# EAGLE design schematic (EAGLE 9.4.2)
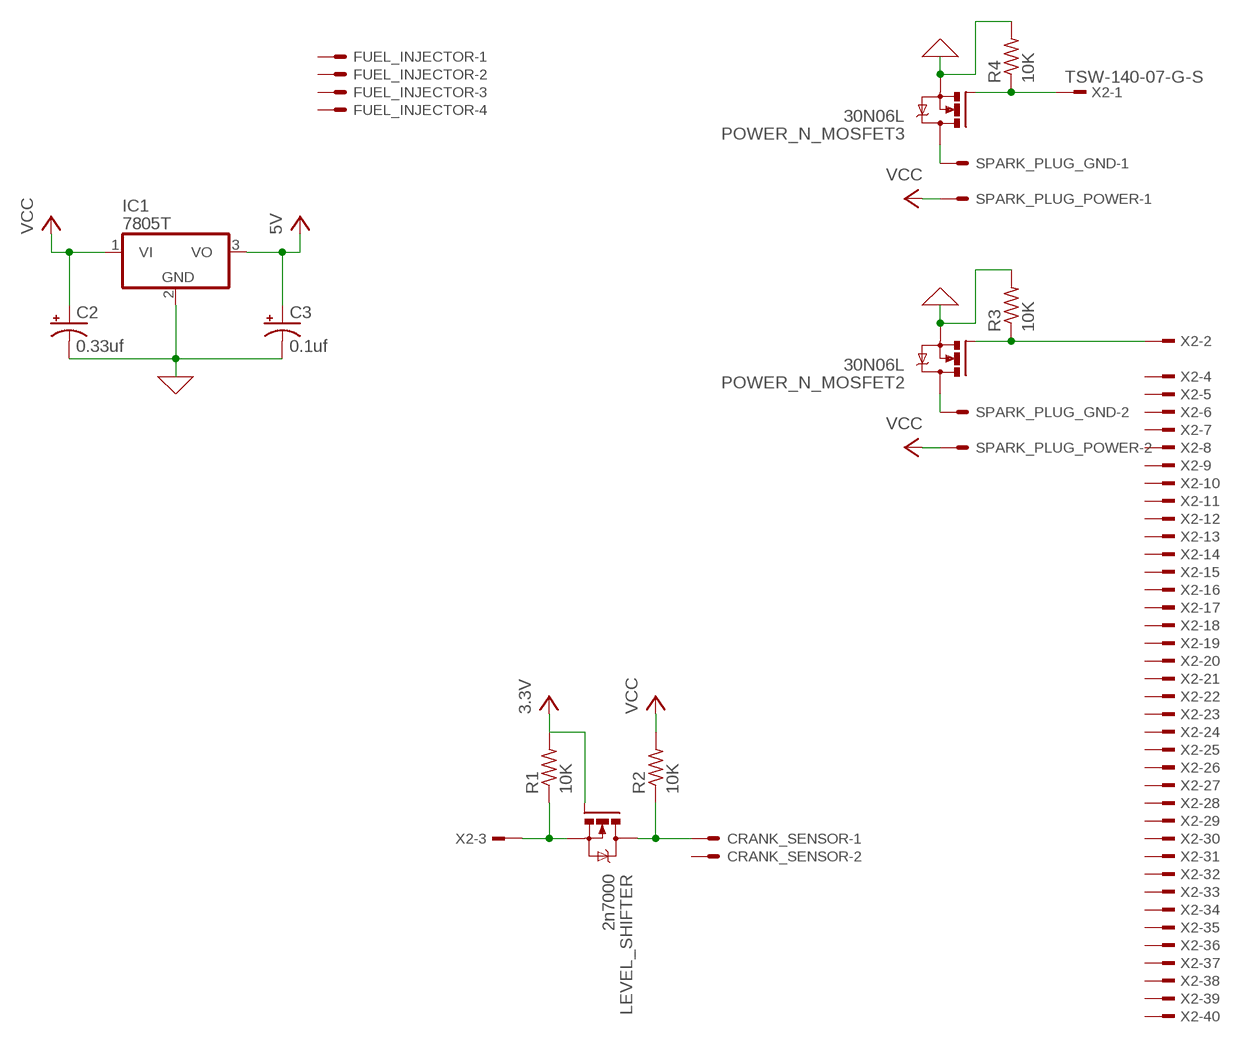
[diagram p0: schematic, sheet 1]

## Parts
C2  0.33uf  CPOL-USE2.5-5  [E2,5-5]
C3  0.1uf  CPOL-USE2.5-5  [E2,5-5]
CRANK_SENSOR  KK-156-2  [KK-156-2]
FUEL_INJECTOR  KK-156-4  [KK-156-4]
IC1  7805T  [TO220H]
LEVEL_SHIFTER  2n7000  IRF520  [TO220BV]
POWER_N_MOSFET2  30N06L  IRF520  [TO220BV]
POWER_N_MOSFET3  30N06L  IRF520  [TO220BV]
R1  10K  R-US_0207/7  [0207/7]
R2  10K  R-US_0207/7  [0207/7]
R3  10K  R-US_0207/7  [0207/7]
R4  10K  R-US_0207/7  [0207/7]
SPARK_PLUG_GND  KK-156-2  [KK-156-2]
SPARK_PLUG_POWER  KK-156-2  [KK-156-2]
X2  TSW-140-07-G-S  [TSW-140-XX-G-S]

## Nets
0: C2.- C3.- IC1.2(GND) POWER_N_MOSFET2.S POWER_N_MOSFET3.S R3.2 R4.2 ; supply symbol labelled GND
N$1: POWER_N_MOSFET3.G R4.1 X2.1
N$2: POWER_N_MOSFET2.G R3.1 X2.2
N$3: POWER_N_MOSFET3.D SPARK_PLUG_GND.1
N$4: POWER_N_MOSFET2.D SPARK_PLUG_GND.2
N$5: LEVEL_SHIFTER.S R1.1 X2.3
N$6: LEVEL_SHIFTER.G R1.2 ; supply symbol labelled 3.3V
N$7: CRANK_SENSOR.1 LEVEL_SHIFTER.D R2.1
VCC: C2.+ C3.+ IC1.1(VI) IC1.3(VO) R2.2 SPARK_PLUG_POWER.1 SPARK_PLUG_POWER.2 ; supply symbol labelled 5V
Unconnected: CRANK_SENSOR.2 FUEL_INJECTOR.1 FUEL_INJECTOR.2 FUEL_INJECTOR.3 FUEL_INJECTOR.4 X2.4 X2.5 X2.6 X2.7 X2.8 X2.9 X2.10 X2.11 X2.12 X2.13 X2.14 X2.15 X2.16 X2.17 X2.18 X2.19 X2.20 X2.21 X2.22 X2.23 X2.24 X2.25 X2.26 X2.27 X2.28 X2.29 X2.30 X2.31 X2.32 X2.33 X2.34 X2.35 X2.36 X2.37 X2.38 X2.39 X2.40

## Library data of the parts
C2 C3 = rcl:CPOL-US: POLARIZED CAPACITOR, American symbol; SPICEPREFIX: C
CRANK_SENSOR SPARK_PLUG_GND SPARK_PLUG_POWER = con-molex:KK-156-2: KK 156 HEADER Source: http://www.molex.com/pdm_docs/sd/026604100_sd.pdf; MF: MOLEX; OC_FARNELL: unknown; OC_NEWARK: unknown
FUEL_INJECTOR = con-molex:KK-156-4: KK 156 HEADER Source: http://www.molex.com/pdm_docs/sd/026604100_sd.pdf; MF: MOLEX; OC_FARNELL: unknown; OC_NEWARK: unknown
IC1 = linear:78*: Positive VOLTAGE REGULATOR Source: http://cache.national.com/ds/LM/LM78L05.pdf http://www.fairchildsemi.com/ds/LM/LM7805.pdf
LEVEL_SHIFTER POWER_N_MOSFET2 POWER_N_MOSFET3 = transistor-power:IRF520: HEXFET Power MOSFET
R1-R4 = rcl:R-US_: RESISTOR, American symbol; SPICEPREFIX: R
X2 = con-samtec:TSW-140-*-G-S: THROUGH-HOLE .025" SQ POST HEADER Source: Samtec TSW.pdf; MF: Samtec Inc.; MPN: TSW-140-07-G-S

## Board
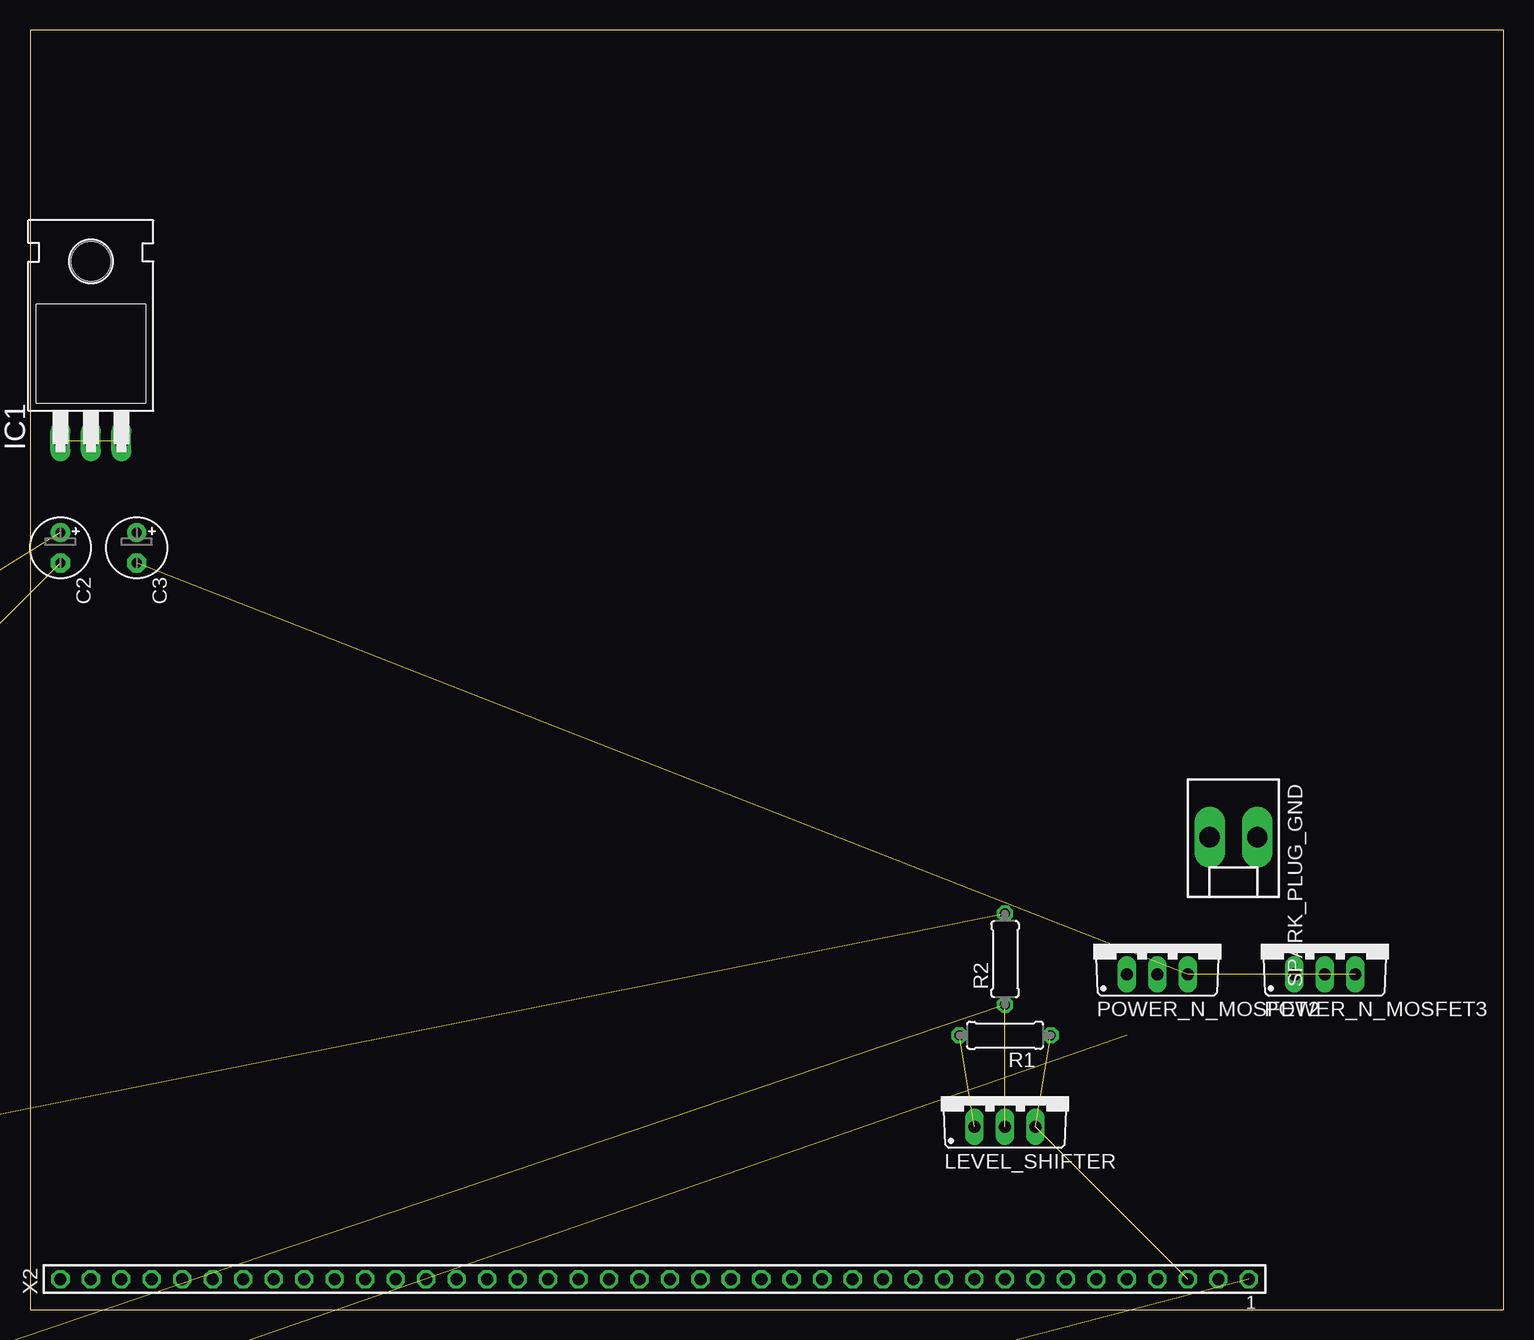
[diagram p1: board, top side]
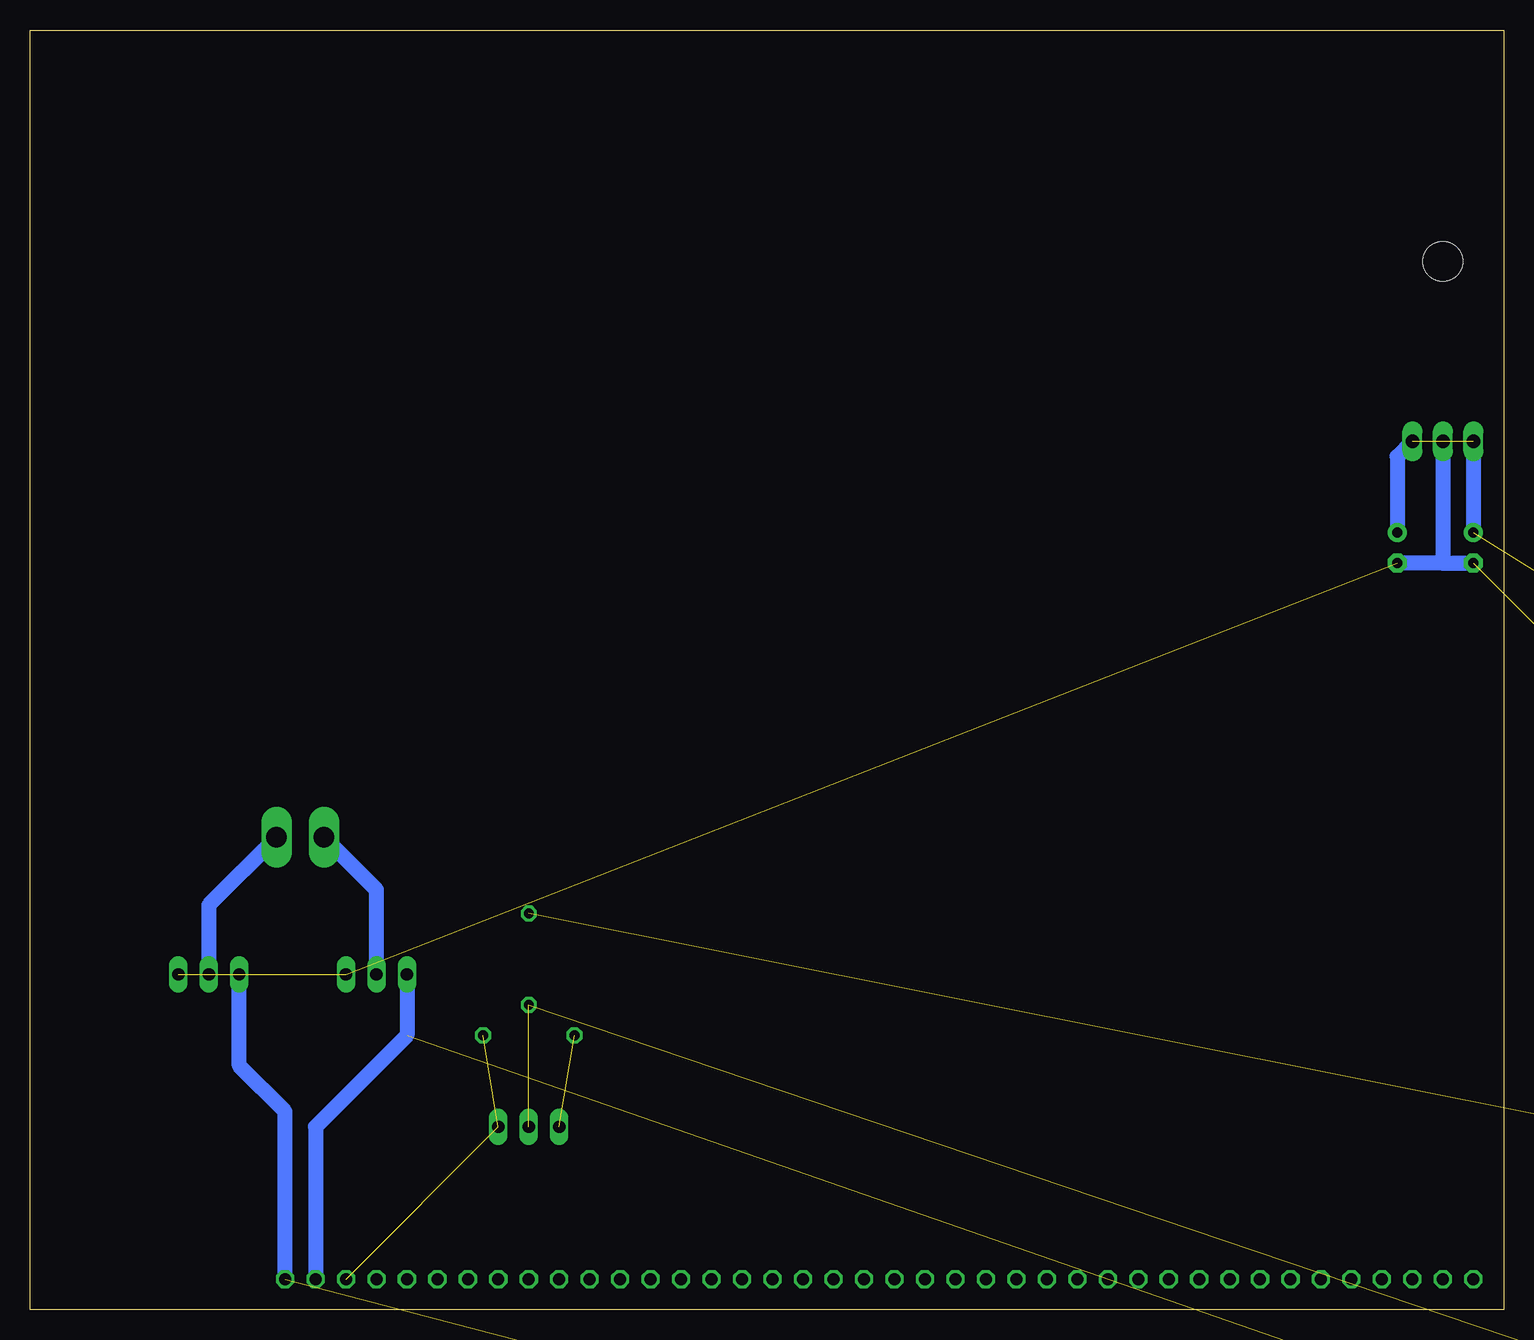
[diagram p2: board, bottom side, seen from below]

Size 122.86 x 106.67 mm. Coordinates in mm from the lower left corner, seen from the top.
Outline: 0,0 122.86,0 122.86,106.67 0,106.67 0,0
Copper layers (1*16): Top 0.035mm / dielectric 1.5mm / Bottom 0.035mm
Design rules "default": minimum track width 6mil, minimum drill 0.35mm, track to track 6mil, track to pad 6mil, pad to pad 6mil, via to via 6mil, smd to smd 6mil, copper to edge 40mil, drill to drill 6mil, minimum pad ring 10mil, minimum via ring 8mil, stop-mask expansion 4mil, vias tented up to drill 0mil, thermal gap 10mil

### Footprints (pad centres in the part's own frame; a part is rotated, then mirrored left to right if it is on the bottom)
E2,5-5 = drill 0.813 pad 1.6: + -1.27,0 | drill 0.813 pad 1.6 octagon: - 1.27,0
KK-156-2 = drill 1.7 pad 2.184 long: 1 -1.98,0; 2 1.98,0
KK-156-4 = drill 1.7 pad 2.184 long: 1 -5.94,0; 2 -1.98,0; 3 1.98,0; 4 5.94,0
TO220H = drill 1.118 long: 1 -2.54,-10.16; 2 0,-10.16; 3 2.54,-10.16 | hole 3.302: 0,4.826
TO220BV = drill 1.016 long: D 0,-2.54; G -2.54,-2.54; S 2.54,-2.54
0207/7 = drill 0.813 octagon: 1 -3.81,0; 2 3.81,0
TSW-140-XX-G-S = drill 1 pad 1.5 octagon: 1 49.53,0; 2 46.99,0; 3 44.45,0; 4 41.91,0; 5 39.37,0; 6 36.83,0; 7 34.29,0; 8 31.75,0; 9 29.21,0; 10 26.67,0; 11 24.13,0; 12 21.59,0; 13 19.05,0; 14 16.51,0; 15 13.97,0; 16 11.43,0; 17 8.89,0; 18 6.35,0; 19 3.81,0; 20 1.27,0; 21 -1.27,0; 22 -3.81,0; 23 -6.35,0; 24 -8.89,0; 25 -11.43,0; 26 -13.97,0; 27 -16.51,0; 28 -19.05,0; 29 -21.59,0; 30 -24.13,0; 31 -26.67,0; 32 -29.21,0; 33 -31.75,0; 34 -34.29,0; 35 -36.83,0; 36 -39.37,0; 37 -41.91,0; 38 -44.45,0; 39 -46.99,0; 40 -49.53,0

### Placement (x,y rotation side)
C2  2.54,63.5 270 top
C3  8.89,63.5 270 top
CRANK_SENSOR  -111.76,-40.64 0 top  (outside the outline)
FUEL_INJECTOR  -21.59,43.18 0 top  (outside the outline)
IC1  5.08,82.55 0 top
LEVEL_SHIFTER  81.28,17.78 0 top
POWER_N_MOSFET2  93.98,30.48 0 top
POWER_N_MOSFET3  107.95,30.48 0 top
R1  81.28,22.86 180 top
R2  81.28,29.21 90 top
R3  -113.03,-49.53 0 top  (outside the outline)
R4  -113.03,-54.61 0 top  (outside the outline)
SPARK_PLUG_GND  100.33,39.37 180 top
SPARK_PLUG_POWER  -111.76,-5.08 0 top  (outside the outline)
X2  52.07,2.54 0 top

### Tracks (layer width: path | path; a pad name or v marks a point on that pad's centre or on a via)
0  (4 unrouted)
  Bottom 1.27: IC1.2 5.08,62.23 | 5.08,62.23 C2.- | 5.08,62.23 C3.-
N$1  (1 unrouted)
  Bottom 1.27: POWER_N_MOSFET3.G 105.41,20.32 101.6,16.51 X2.1
N$2  (1 unrouted)
  Bottom 1.27: POWER_N_MOSFET2.G 91.44,22.86 99.06,15.24 X2.2
N$3
  Bottom 1.27: SPARK_PLUG_GND.1 107.95,33.73 POWER_N_MOSFET3.D
N$4
  Bottom 1.27: POWER_N_MOSFET2.D 93.98,35 SPARK_PLUG_GND.2
N$5  (2 unrouted)
N$6  (1 unrouted)
N$7  (2 unrouted)
VCC  (4 unrouted)
  Bottom 1.27: IC1.1 C2.+ | IC1.3 8.89,71.12 C3.+